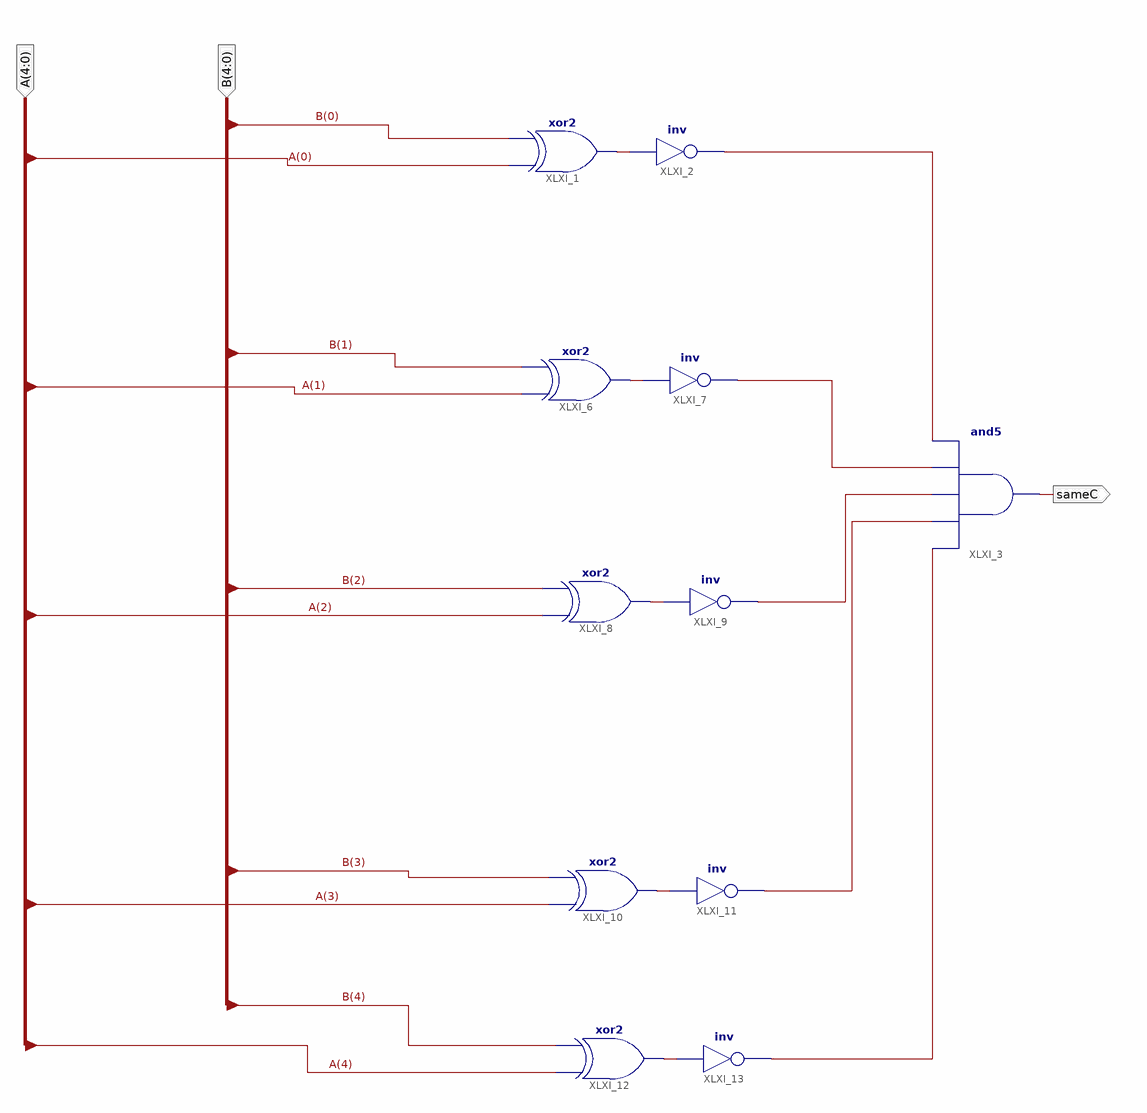
[diagram p0: schematic sheet 1]
// Xilinx ISE schematic sameCLK.sch (spartan3e) as structural Verilog: 11 symbols, 3 ports
module sameCLK (
  input  [4:0] A,
  input  [4:0] B,
  output sameC
);

  wire XLXN_3, XLXN_5, XLXN_6, XLXN_7, XLXN_8, XLXN_9, XLXN_10, XLXN_11, XLXN_14, XLXN_16;

  and XLXI_3 (sameC, XLXN_16, XLXN_14, XLXN_10, XLXN_9, XLXN_8);
  xor XLXI_1 (XLXN_3, A[0], B[0]);
  not XLXI_2 (XLXN_8, XLXN_3);
  xor XLXI_6 (XLXN_5, A[1], B[1]);
  not XLXI_7 (XLXN_9, XLXN_5);
  xor XLXI_8 (XLXN_6, A[2], B[2]);
  not XLXI_9 (XLXN_10, XLXN_6);
  xor XLXI_10 (XLXN_7, A[3], B[3]);
  not XLXI_11 (XLXN_14, XLXN_7);
  xor XLXI_12 (XLXN_11, A[4], B[4]);
  not XLXI_13 (XLXN_16, XLXN_11);
endmodule
